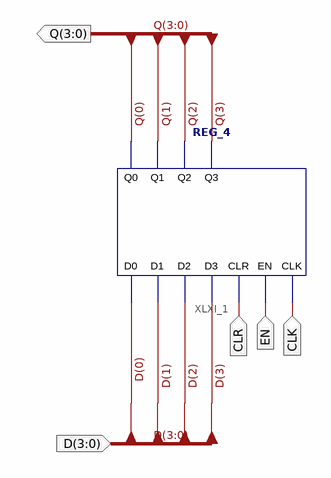
[diagram p0: schematic sheet 1]
// Xilinx ISE schematic COUNTER_4.sch (spartan3e) as structural Verilog: 1 symbols, 5 ports
module COUNTER_4 (
  input  [3:0] D,
  input  CLK,
  input  CLR,
  input  EN,
  output [3:0] Q
);

  REG_4 XLXI_1 (
    .CLK(CLK), .CLR(CLR), .D0(D[0]), .D1(D[1]), .D2(D[2]), .D3(D[3]), .EN(EN), .Q0(Q[0]), .Q1(Q[1]),
    .Q2(Q[2]), .Q3(Q[3]));
endmodule
